# Altium schematic sheet WifiModule.SchDoc
size A
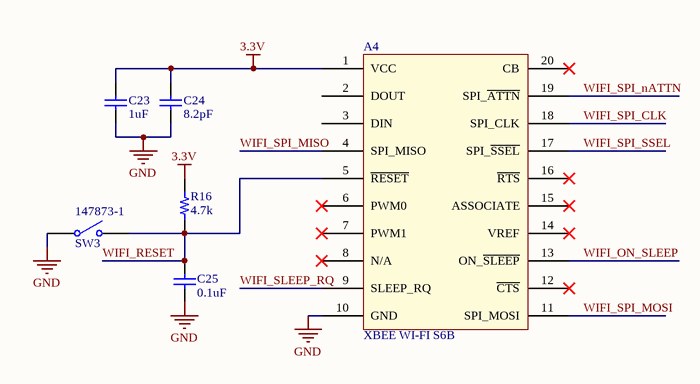
[diagram p0: WifiModule.SchDoc]

## Parts
A4  XBEE WI-FI S6B  [Xbee_TH]
C23  value 1uF  [C0603]  (hidden comment: CAP CER 0603 1uF 25V X7R 20%)
C24  value 8.2pF  [C0603]  (hidden comment: CAP CER 0603 8.2pF 50V COG ±0.5pF)
C25  value 0.1uF  [C0603]  (hidden comment: CAP CER 0603 0.1uF 50V C0G 10%)
R16  value 4.7k  [R0603]  (hidden comment: RES 0603 4.7k 5% 0.1W)
SW3  147873-1  [147873]

## Nets
3.3V: A4.1(VCC) C23.2 C24.2 R16.2
GND: A4.10(GND) C23.1 C24.1 C25.1 SW3.1(COMMON)
WIFI_ON_SLEEP: A4.13(ON_~{SLEEP})
WIFI_RESET: A4.5(~{RESET}) C25.2 R16.1 SW3.2(NO)
WIFI_SLEEP_RQ: A4.9(SLEEP_RQ)
WIFI_SPI_CLK: A4.18(SPI_CLK)
WIFI_SPI_MISO: A4.4(SPI_MISO)
WIFI_SPI_MOSI: A4.11(SPI_MOSI)
WIFI_SPI_nATTN: A4.19(SPI_~{ATTN})
WIFI_SPI_SSEL: A4.17(SPI_~{SSEL})

Not connected (* = marked no-connect by the designer): A4 2(DOUT) 3(DIN) 6(PWM0)* 7(PWM1)* 8(N/A)* 12(~{CTS})* 14(VREF)* 15(ASSOCIATE)* 16(~{RTS})* 20(CB)*

## Library data of the parts
A4 = XBEE WI-FI S6B: Module Wifi; Manufacturer: Digi International; Part_Number: XB2B-WFST-001; Price: 36.19; Supplier 1: Digi-Key; Supplier_Link: http://www.digikey.com/product-search/en?mpart=XB2B-WFST-001&vendor=602; Supplier Part Number 1: 602-1380-ND
C23 = CAP CER 0603 1uF 25V X7R 20%: 1uF ceramic capacitor; Manufacturer: TDK Corporation; Part_Number: CGA3E1X7R1E105M080AC; Supplier_Link: http://www.digikey.ca/product-detail/en/CGA3E1X7R1E105M080AC/445-12548-1-ND/3954214; Tolerance: 20%; Voltage rating: 25V; Price: 0.24; Supplier 1: Digi-Key; Supplier Part Number 1: 445-12548-1-ND; Price_10: 0.171
C24 = CAP CER 0603 8.2pF 50V COG ±0.5pF: 8.2pF 50V Ceramic Capacitor C0G, NP0 0603; Manufacturer: Murata-Electronics-North-America; Part_Number: GCM1885C1H8R2DA16D; Price: 0.15; Price_10: 0.111; Supplier 1: Digi-Key; Supplier_Link: http://www.digikey.ca/product-detail/en/murata-electronics-north-america/GCM1885C1H8R2DA16D/490-11155-1-ND/5332995; Supplier Part Number 1: 490-11155-1-ND; Tolerance: ±0.5pF; Voltage rating: 50V
C25 = CAP CER 0603 0.1uF 50V C0G 10%: 0.1uF ceramic capacitor; Manufacturer: TDK Corporation; Part_Number: CGA3E2X7R1H104K080AA; Supplier_Link: http://www.digikey.ca/product-detail/en/CGA3E2X7R1H104K080AA/445-5666-1-ND/2443706; Tolerance: 10%; Voltage rating: 50V; Price: 0.14; Price_10: 0.102
R16 = RES 0603 4.7k 5% 0.1W: 4.7 kOhms resistor; Part_Number: CRCW06034K70JNEA; Manufacturer: Vishay; Price: 0.15; Supplier_Link: http://www.digikey.ca/product-detail/en/CRCW06034K70JNEA/541-4.7KGCT-ND/1179385; Price_10: 0.033
SW3 = 147873-1: Pushbutton switch SPST, 2 pins; Manufacturer: TE Connectivity; Supplier_Link: http://www.te.com/usa-en/product-147873-1.html; Price: 0.30; Part_Number: 147873-1